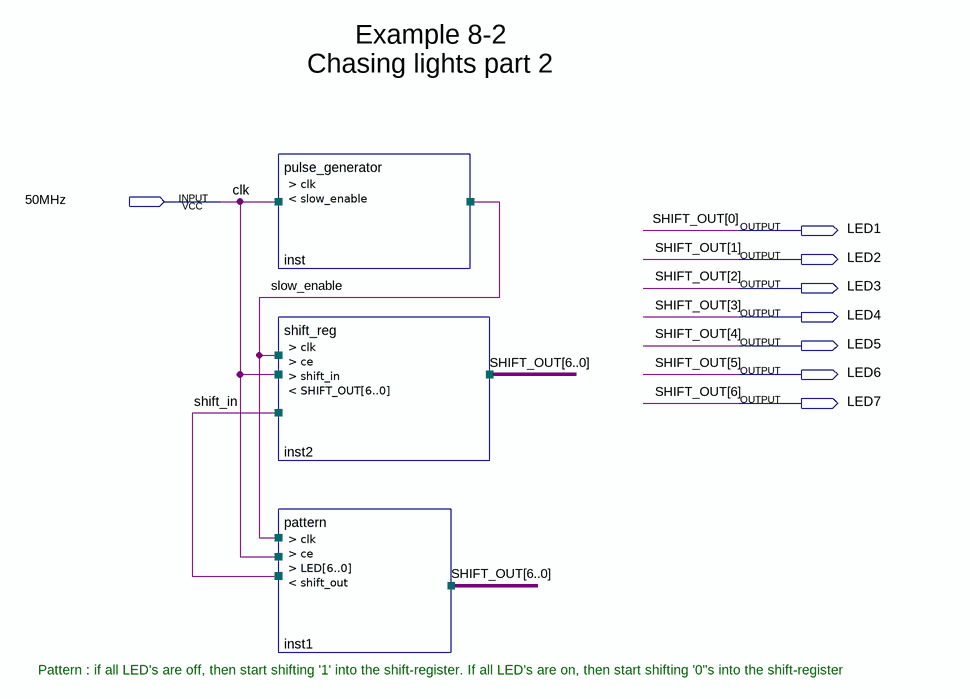
[diagram p0: schematic sheet]
// Quartus schematic ex8_2.bdf as structural Verilog: 3 symbols, 8 pins
module ex8_2 (
  input  \50MHz ,
  output LED1,
  output LED2,
  output LED3,
  output LED4,
  output LED5,
  output LED6,
  output LED7
);

  wire shift_in, slow_enable;

  pulse_generator inst (.clk(\50MHz ), .slow_enable(slow_enable));
  shift_reg inst2 (
    .clk(\50MHz ), .ce(slow_enable), .shift_in(shift_in),
    .SHIFT_OUT({LED7, LED6, LED5, LED4, LED3, LED2, LED1}));
  pattern inst1 (
    .clk(\50MHz ), .ce(slow_enable), .LED({LED7, LED6, LED5, LED4, LED3, LED2, LED1}), .shift_out(shift_in));

  // Other names for the same wires on the sheet: clk = \50MHz ;
  //   SHIFT_OUT[6:0] = {LED7, LED6, LED5, LED4, LED3, LED2, LED1}

  // Notes on the sheet:
  //   Example 8-2
  //   Chasing lights part 2
  //   Pattern : if all LED's are off, then start shifting '1' into the shift-register. If all LED's are on, then start shifting '0''s into the shift-register
endmodule
